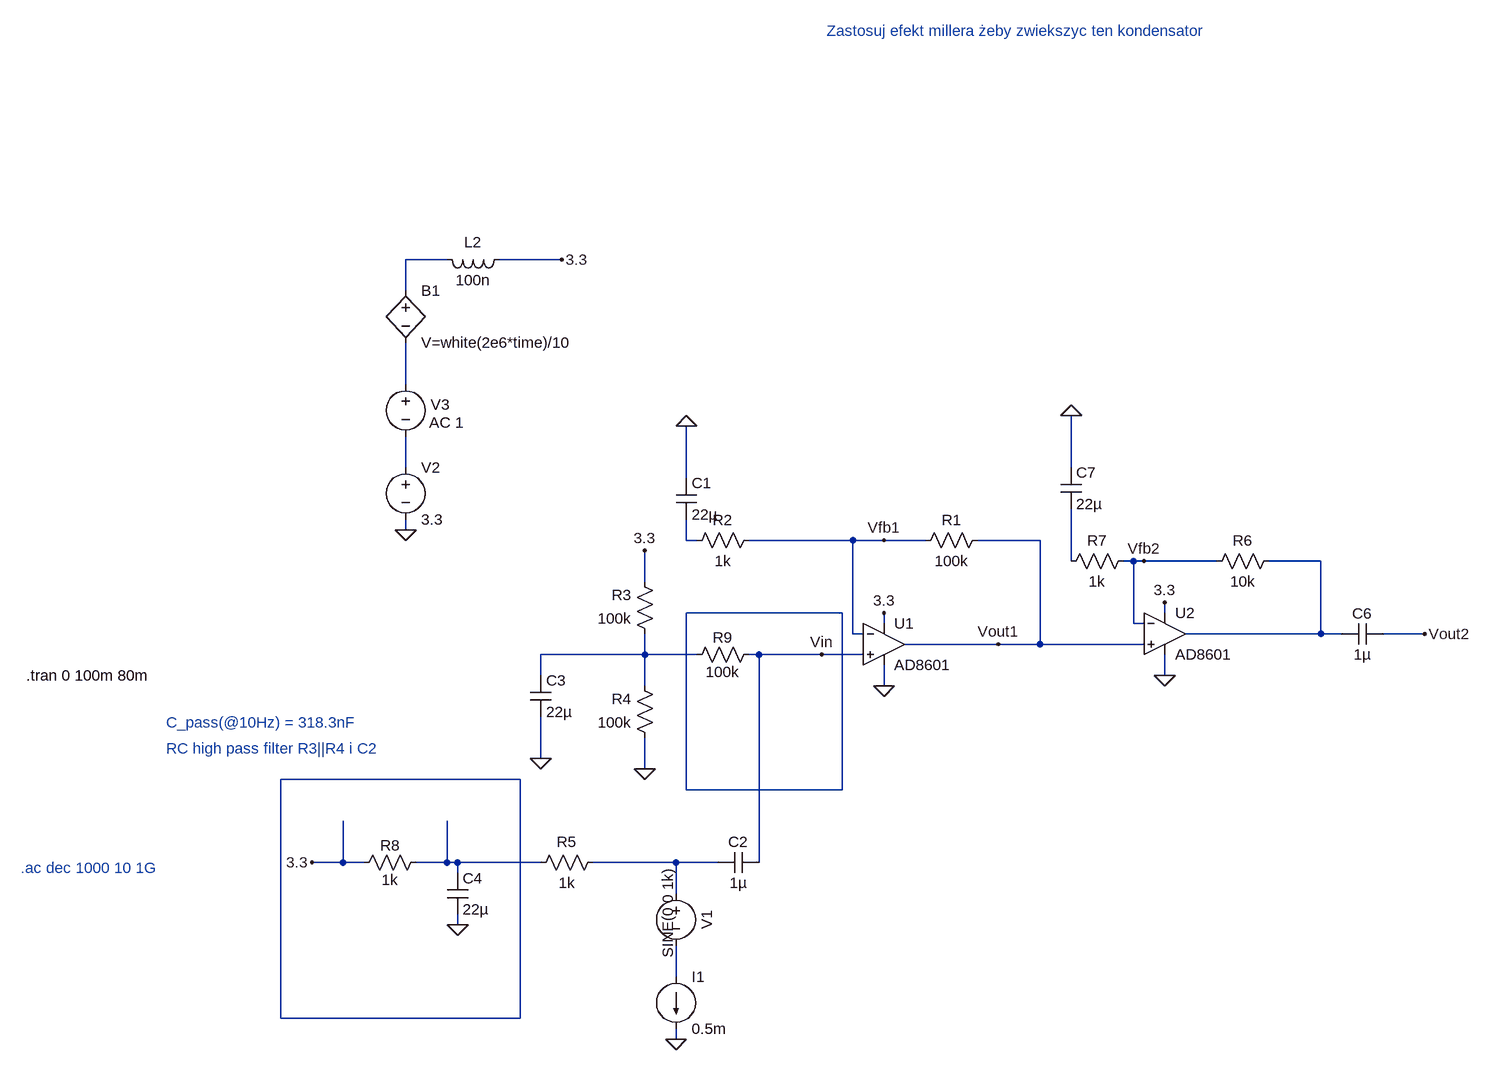
[diagram p0: schematic micAmp_cascade_ps_noise.asc]
micAmp_cascade_ps_noise.asc, the LTspice schematic file:
Version 4
SHEET 1 1668 772
WIRE -336 -448 -400 -448
WIRE -160 -448 -256 -448
WIRE -400 -400 -400 -448
WIRE -400 -256 -400 -320
WIRE -400 -128 -400 -176
WIRE 624 -128 624 -208
WIRE 32 -112 32 -192
WIRE -400 -32 -400 -48
WIRE 32 -16 32 -48
WIRE 48 -16 32 -16
WIRE 288 -16 128 -16
WIRE 336 -16 288 -16
WIRE 400 -16 336 -16
WIRE 576 -16 480 -16
WIRE 624 16 624 -64
WIRE 720 16 704 16
WIRE 736 16 720 16
WIRE 848 16 736 16
WIRE 1008 16 928 16
WIRE -32 48 -32 0
WIRE 272 96 32 96
WIRE 768 96 768 80
WIRE 336 112 336 96
WIRE 720 112 720 16
WIRE 736 112 720 112
WIRE 288 128 288 -16
WIRE 304 128 288 128
WIRE 1008 128 1008 16
WIRE 1008 128 800 128
WIRE 1040 128 1008 128
WIRE 1168 128 1104 128
WIRE 512 144 368 144
WIRE 576 144 576 -16
WIRE 576 144 512 144
WIRE 736 144 576 144
WIRE -32 160 -32 128
WIRE -32 160 -192 160
WIRE 48 160 -32 160
WIRE 144 160 128 160
WIRE 240 160 144 160
WIRE 304 160 240 160
WIRE -192 192 -192 160
WIRE 768 192 768 160
WIRE -32 208 -32 160
WIRE 336 208 336 176
WIRE -192 320 -192 256
WIRE -32 336 -32 288
WIRE -224 352 -592 352
WIRE 32 368 32 96
WIRE 272 368 272 96
WIRE 272 368 32 368
WIRE -496 480 -496 416
WIRE -496 480 -544 480
WIRE -464 480 -496 480
WIRE -336 480 -336 416
WIRE -336 480 -384 480
WIRE -320 480 -336 480
WIRE -192 480 -320 480
WIRE 16 480 -112 480
WIRE 80 480 16 480
WIRE 144 480 144 160
WIRE -320 496 -320 480
WIRE 16 528 16 480
WIRE -320 576 -320 560
WIRE 16 656 16 608
WIRE -592 720 -592 352
WIRE -224 720 -224 352
WIRE -224 720 -592 720
WIRE 16 752 16 736
FLAG -32 336 0
FLAG -400 -32 0
FLAG -160 -448 3.3
FLAG 336 96 3.3
FLAG 336 208 0
FLAG 32 -192 0
FLAG 768 80 3.3
FLAG 768 192 0
FLAG 624 -208 0
FLAG 240 160 Vin
FLAG 1168 128 Vout2
FLAG 336 -16 Vfb1
FLAG 736 16 Vfb2
FLAG 512 144 Vout1
FLAG -32 0 3.3
FLAG -192 320 0
FLAG -544 480 3.3
FLAG -320 576 0
FLAG 16 752 0
SYMBOL OpAmps\\AD8601 336 80 R0
SYMATTR InstName U1
SYMBOL res 496 -32 R90
WINDOW 0 0 56 VBottom 2
WINDOW 3 32 56 VTop 2
SYMATTR InstName R1
SYMATTR Value 100k
SYMBOL res 144 -32 R90
WINDOW 0 0 56 VBottom 2
WINDOW 3 32 56 VTop 2
SYMATTR InstName R2
SYMATTR Value 1k
SYMBOL res -16 144 R180
WINDOW 0 36 76 Left 2
WINDOW 3 36 40 Left 2
SYMATTR InstName R3
SYMATTR Value 100k
SYMBOL res -16 304 R180
WINDOW 0 36 76 Left 2
WINDOW 3 36 40 Left 2
SYMATTR InstName R4
SYMATTR Value 100k
SYMBOL voltage -400 -144 R0
WINDOW 123 0 0 Left 0
WINDOW 39 0 0 Left 0
SYMATTR InstName V2
SYMATTR Value 3.3
SYMBOL ind -240 -464 R90
WINDOW 0 5 56 VBottom 2
WINDOW 3 32 56 VTop 2
SYMATTR InstName L2
SYMATTR Value 100n
SYMBOL cap 144 464 R90
WINDOW 0 0 32 VBottom 2
WINDOW 3 32 32 VTop 2
SYMATTR InstName C2
SYMATTR Value 1µ
SYMBOL res -208 496 R270
WINDOW 0 32 56 VTop 2
WINDOW 3 0 56 VBottom 2
SYMATTR InstName R5
SYMATTR Value 1k
SYMBOL cap 16 -112 R0
SYMATTR InstName C1
SYMATTR Value 22µ
SYMBOL OpAmps\\AD8601 768 64 R0
SYMATTR InstName U2
SYMBOL res 944 0 R90
WINDOW 0 0 56 VBottom 2
WINDOW 3 32 56 VTop 2
SYMATTR InstName R6
SYMATTR Value 10k
SYMBOL res 720 0 R90
WINDOW 0 0 56 VBottom 2
WINDOW 3 32 56 VTop 2
SYMATTR InstName R7
SYMATTR Value 1k
SYMBOL cap 1104 112 R90
WINDOW 0 0 32 VBottom 2
WINDOW 3 32 32 VTop 2
SYMATTR InstName C6
SYMATTR Value 1µ
SYMBOL cap 608 -128 R0
SYMATTR InstName C7
SYMATTR Value 22µ
SYMBOL voltage -400 -272 R0
WINDOW 0 39 47 Left 2
WINDOW 123 36 75 Left 2
WINDOW 39 0 0 Left 0
SYMATTR InstName V3
SYMATTR Value ""
SYMATTR Value2 AC 1
SYMBOL res 144 144 R90
WINDOW 0 5 56 VBottom 2
WINDOW 3 27 56 VTop 2
SYMATTR InstName R9
SYMATTR Value 100k
SYMBOL cap -208 192 R0
SYMATTR InstName C3
SYMATTR Value 22µ
SYMBOL cap -336 496 R0
SYMATTR InstName C4
SYMATTR Value 22µ
SYMBOL res -368 464 R90
WINDOW 0 5 56 VBottom 2
WINDOW 3 27 56 VTop 2
SYMATTR InstName R8
SYMATTR Value 1k
SYMBOL current 16 656 R0
WINDOW 123 0 0 Left 0
WINDOW 39 0 0 Left 0
SYMATTR InstName I1
SYMATTR Value 0.5m
SYMBOL voltage 16 512 R0
WINDOW 0 32 56 VTop 2
WINDOW 3 3 46 VBottom 2
WINDOW 123 27 55 VBottom 2
WINDOW 39 0 0 Left 0
SYMATTR InstName V1
SYMATTR Value SINE(0 0 1k)
SYMBOL bv -400 -416 R0
SYMATTR InstName B1
SYMATTR Value V=white(2e6*time)/10
TEXT -984 192 Left 2 !.tran 0 100m 80m
TEXT -768 304 Left 2 ;RC high pass filter R3||R4 i C2
TEXT -768 264 Left 2 ;C_pass(@10Hz) = 318.3nF
TEXT 248 -800 Left 2 ;Zastosuj efekt millera żeby zwiekszyc ten kondensator
TEXT -992 488 Left 2 ;.ac dec 1000 10 1G

The netlist it stands for:
* micAmp_cascade_ps_noise.asc
XU1 Vin Vfb1 3.3 0 Vout1 AD8601  ; pins In+ In- V+ V- OUT
R1 Vout1 Vfb1 100k
R2 Vfb1 N004 1k
R3 N008 3.3 100k
R4 0 N008 100k
V2 N003 0 3.3
L2 3.3 N001 100n
C2 Vin N011 1µ
R5 N010 N011 1k
C1 0 N004 22µ
XU2 Vout1 Vfb2 3.3 0 N006 AD8601  ; pins In+ In- V+ V- OUT
R6 N006 Vfb2 10k
R7 Vfb2 N005 1k
C6 Vout2 N006 1µ
C7 0 N005 22µ
V3 N002 N003 AC 1
R9 Vin N008 100k
C3 N008 0 22µ
C4 N010 0 22µ
R8 N010 3.3 1k
I1 N012 0 0.5m
V1 N011 N012 SINE(0 0 1k)
B1 N001 N002 V=white(2e6*time)/10
.tran 0 100m 80m
* RC high pass filter R3||R4 i C2
* C_pass(@10Hz) = 318.3nF
* Zastosuj efekt millera żeby zwiekszyc ten kondensator
* .ac dec 1000 10 1G
.backanno
.end